# Altium schematic sheet S3C_FrontpanelInterface.SchDoc
size A4; Organization: UltraZohm; SheetNumber: 13
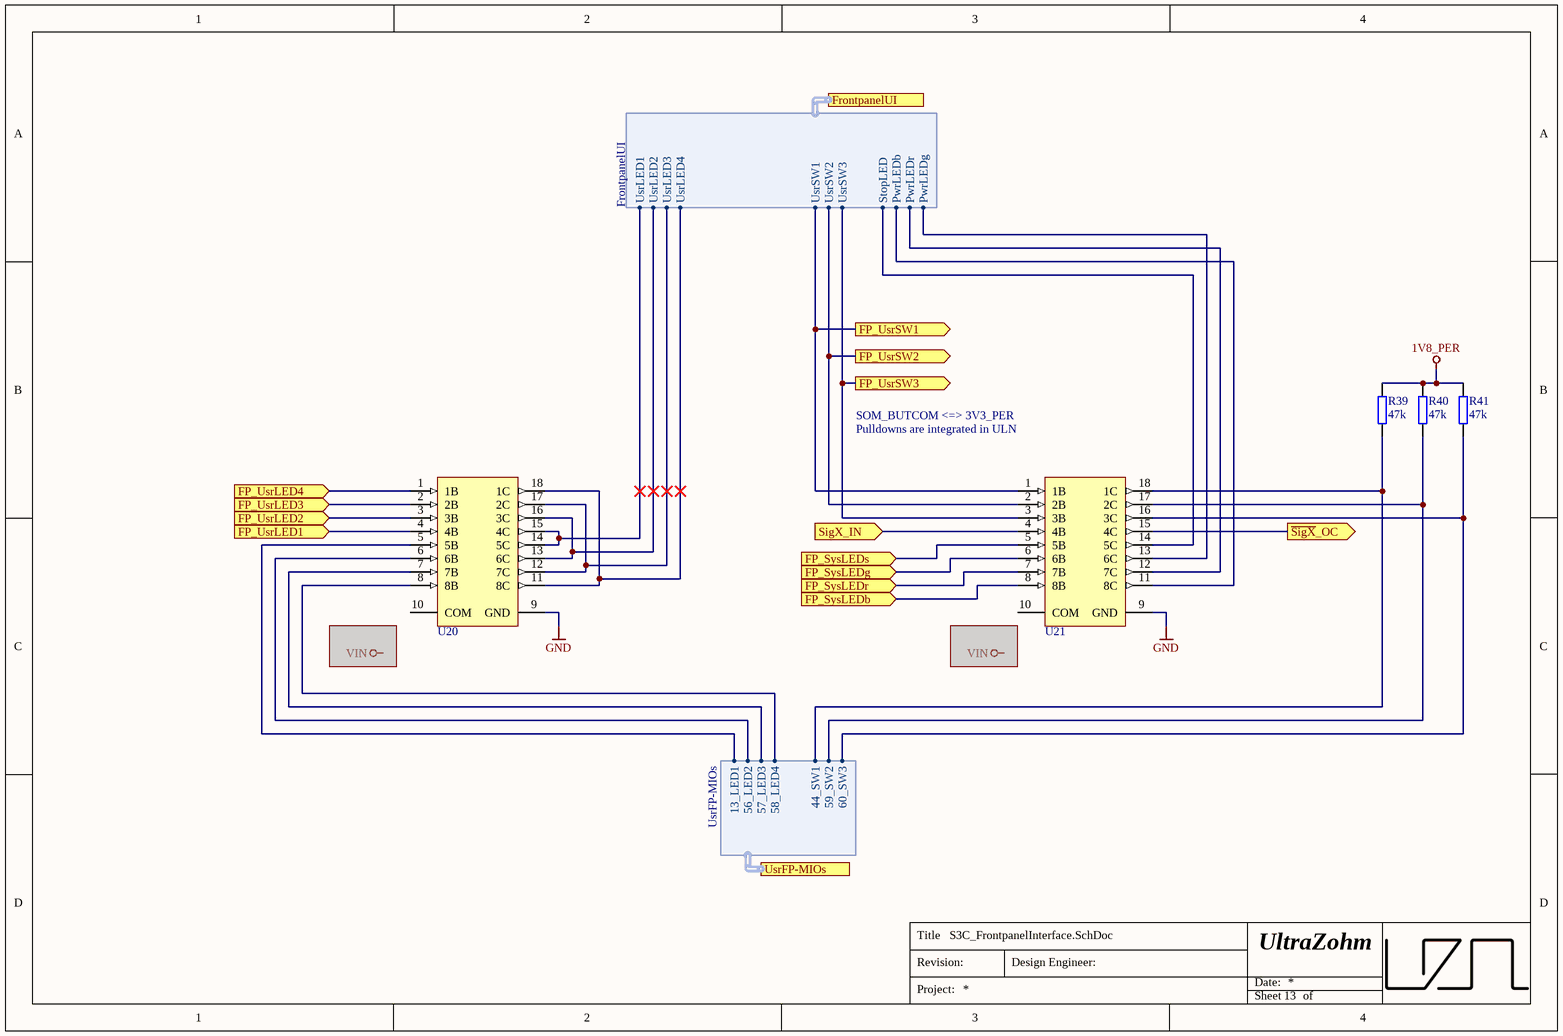
[diagram p0: S3C_FrontpanelInterface.SchDoc]

## Parts
R39  47k  [R_0603_TE]
R40  47k  [R_0603_TE]
R41  47k  [R_0603_TE]
U20  ULN2803A  [FP-SOICW-18LD-PL-1-IPC_B]  (value not drawn)
U21  ULN2803A  [FP-SOICW-18LD-PL-1-IPC_B]  (value not drawn)

## Ports
FP_SysLEDb (in), FP_SysLEDg (in), FP_SysLEDr (in), FP_SysLEDs (in), FP_UsrLED1 (in), FP_UsrLED2 (in), FP_UsrLED3 (in), FP_UsrLED4 (in), FP_UsrSW1 (out), FP_UsrSW2 (out), FP_UsrSW3 (out), FrontpanelUI (harness FrontpanelUI), SigX_IN (in), UsrFP-MIOs (harness UsrFP-MIOs), ~{SigX}_OC (out)

## Harnesses
UsrFP-MIOs: 13_LED1, 44_SW1, 56_LED2, 57_LED3, 58_LED4, 59_SW2, 60_SW3
FrontpanelUI: UsrLED1, UsrLED2, UsrLED3, UsrLED4, UsrSW1, UsrSW2, UsrSW3, StopLED, PwrLEDb, PwrLEDr, PwrLEDg

## Nets
1V8_PER: R39.2 R40.2 R41.2
GND: U20.9(GND) U21.9(GND)
FP_SysLEDb: U21.8(8B) ; port FP_SysLEDb
FP_SysLEDg: U21.6(6B) ; port FP_SysLEDg
FP_SysLEDr: U21.7(7B) ; port FP_SysLEDr
FP_SysLEDs: U21.5(5B) ; port FP_SysLEDs
FP_UsrLED1: U20.4(4B) ; port FP_UsrLED1
FP_UsrLED2: U20.3(3B) ; port FP_UsrLED2
FP_UsrLED3: U20.2(2B) ; port FP_UsrLED3
FP_UsrLED4: U20.1(1B) ; port FP_UsrLED4
FP_UsrSW1: U21.1(1B) ; port FP_UsrSW1, port FrontpanelUI.UsrSW1
FP_UsrSW2: U21.2(2B) ; port FP_UsrSW2, port FrontpanelUI.UsrSW2
FP_UsrSW3: U21.3(3B) ; port FP_UsrSW3, port FrontpanelUI.UsrSW3
~{SigX}_OC: U21.15(4C) ; port ~{SigX}_OC
SigX_IN: U21.4(4B) ; port SigX_IN
NetR39_1: R39.1 U21.18(1C) ; port UsrFP-MIOs.44_SW1
NetR40_1: R40.1 U21.17(2C) ; port UsrFP-MIOs.59_SW2
NetR41_1: R41.1 U21.16(3C) ; port UsrFP-MIOs.60_SW3
NetU20_5: U20.5(5B) ; port UsrFP-MIOs.13_LED1
NetU20_6: U20.6(6B) ; port UsrFP-MIOs.56_LED2
NetU20_7: U20.7(7B) ; port UsrFP-MIOs.57_LED3
NetU20_8: U20.8(8B) ; port UsrFP-MIOs.58_LED4
NetU20_11: U20.11(8C) U20.18(1C) ; port FrontpanelUI.UsrLED4
NetU20_12: U20.12(7C) U20.17(2C) ; port FrontpanelUI.UsrLED3
NetU20_13: U20.13(6C) U20.16(3C) ; port FrontpanelUI.UsrLED2
NetU20_14: U20.14(5C) U20.15(4C) ; port FrontpanelUI.UsrLED1
NetU21_11: U21.11(8C) ; port FrontpanelUI.PwrLEDb
NetU21_12: U21.12(7C) ; port FrontpanelUI.PwrLEDr
NetU21_13: U21.13(6C) ; port FrontpanelUI.PwrLEDg
NetU21_14: U21.14(5C) ; port FrontpanelUI.StopLED

Not connected (* = marked no-connect by the designer): U20 10(COM); U21 10(COM)

## Notes on the sheet
- SOM_BUTCOM <=> 3V3_PER
- Pulldowns are integrated in ULN
- Title
- Revision:
- Design Engineer:
- Date:
- Project:
- Sheet
- of

## Library data of the parts
R39-R41 = UZgen_R_0603_47k: Generic resistor; Manufacturer: UZgen; Tolerance: 1 %; Created from: UZgenTool; Manufacturer Part Number: UZgen_R_0603_47k; PartID: 260; Created On: 02/07/2024 17:29:50; Value: 47k; Device Package: 0603; Mounting Type: SMD; Last Updated: 02/07/2024 17:29:50
U20 U21 = ULN2803A: Darlington Transistors Eight NPN Array; Manufacturer: UMW(Youtai Semiconductor Co., Ltd.); Created from: FRosner; Manufacturer Part Number: ULN2803A; PartID: 17; Created On: 13/06/2024 09:08:03; ComponentLink1Description: Datasheet; ComponentLink1URL: https://wmsc.lcsc.com/wmsc/upload/file/pdf/v2/lcsc/2311091738_UMW-Youtai-Semiconductor-Co---Ltd--ULN2803A_C845537.pdf; Component Type: Darlington Driver; Device Package: SOP-18; Last Updated: 04/09/2024 11:48:15; Mounting Type: SMT; Operating Temperature: -40~85 °C; Series: ULN2803A; Supplier 1: LCSC; Supplier Part Number 1: C845537; Type: Driver; Live Cycle Status: 1; LCSC Part Number: C845537